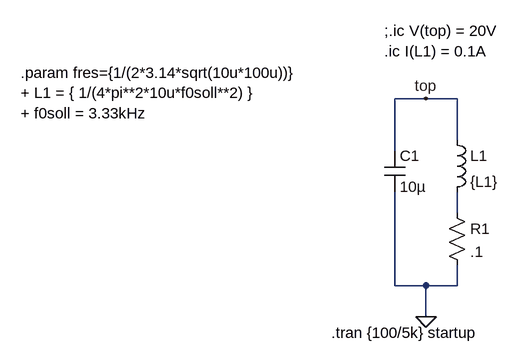
[diagram p0: schematic Draft3.asc]
Draft3.asc, the LTspice schematic file:
Version 4
SHEET 1 880 680
WIRE 160 16 112 16
WIRE 208 16 160 16
WIRE 208 80 208 16
WIRE 112 96 112 16
WIRE 208 192 208 160
WIRE 112 304 112 160
WIRE 160 304 112 304
WIRE 208 304 208 272
WIRE 208 304 160 304
WIRE 160 352 160 304
FLAG 160 352 0
FLAG 160 16 top
SYMBOL cap 96 96 R0
SYMATTR InstName C1
SYMATTR Value 10µ
SYMBOL res 192 176 R0
SYMATTR InstName R1
SYMATTR Value .1
SYMBOL ind 192 64 R0
SYMATTR InstName L1
SYMATTR Value {L1}
TEXT 96 -88 Left 2 !;.ic V(top) = 20V\n.ic I(L1) = 0.1A
TEXT -464 -24 Left 2 !.param fres={1/(2*3.14*sqrt(10u*100u))}\n+ L1 = { 1/(4*pi**2*10u*f0soll**2) }\n+ f0soll = 3.33kHz
TEXT 14 376 Left 2 !.tran {100/5k} startup

The netlist it stands for:
* Draft3.asc
C1 top 0 10µ
R1 N001 0 .1
L1 top N001 {L1}
;.ic V(top) = 20V
.ic I(L1) = 0.1A
.param fres={1/(2*3.14*sqrt(10u*100u))}
+ L1 = { 1/(4*pi**2*10u*f0soll**2) }
+ f0soll = 3.33kHz
.tran {100/5k} startup
.backanno
.end